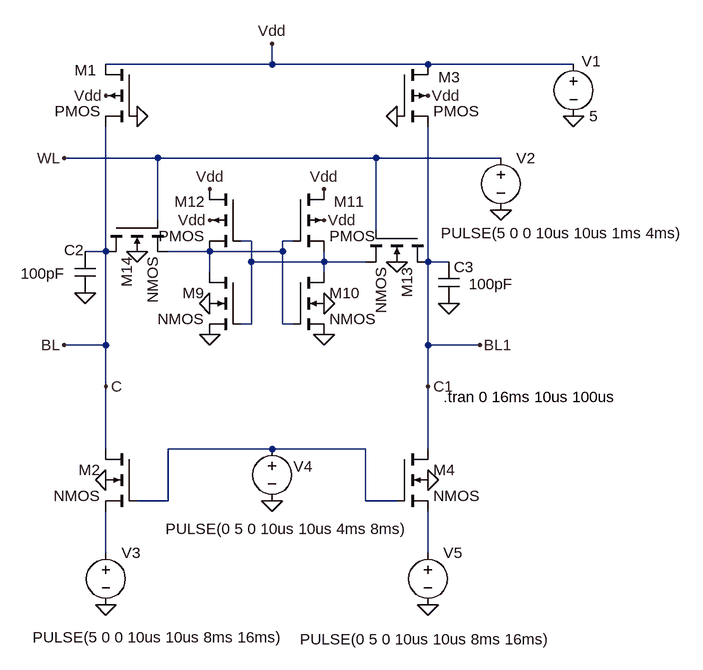
[diagram p0: schematic SRAM.asc]
SRAM.asc, the LTspice schematic file:
Version 4
SHEET 1 1888 884
WIRE 176 -496 176 -528
WIRE 176 -496 -80 -496
WIRE 416 -496 176 -496
WIRE 640 -496 416 -496
WIRE 0 -352 -144 -352
WIRE 336 -352 0 -352
WIRE 528 -352 336 -352
WIRE 0 -256 0 -352
WIRE 336 -240 336 -352
WIRE 144 -224 128 -224
WIRE 208 -224 192 -224
WIRE -80 -208 -80 -400
WIRE -80 -208 -112 -208
WIRE 80 -208 16 -208
WIRE 192 -208 192 -224
WIRE 192 -208 80 -208
WIRE 144 -192 144 -224
WIRE 256 -192 256 -208
WIRE 256 -192 144 -192
WIRE 320 -192 256 -192
WIRE 416 -192 416 -400
WIRE 448 -192 416 -192
WIRE 80 -176 80 -208
WIRE 256 -176 256 -192
WIRE 144 -96 144 -192
WIRE 144 -96 128 -96
WIRE 192 -96 192 -208
WIRE 208 -96 192 -96
WIRE -80 -64 -80 -208
WIRE -80 -64 -144 -64
WIRE 416 -64 416 -192
WIRE 496 -64 416 -64
WIRE -80 0 -80 -64
WIRE 416 0 416 -64
WIRE -80 96 -80 0
WIRE 176 96 16 96
WIRE 320 96 176 96
WIRE 416 96 416 0
WIRE 16 176 16 96
WIRE 16 176 -32 176
WIRE 320 176 320 96
WIRE 368 176 320 176
WIRE -80 256 -80 192
WIRE 416 256 416 192
FLAG -32 -416 0
FLAG 368 -416 0
FLAG -144 -352 WL
FLAG 416 -448 Vdd
FLAG -80 -448 Vdd
FLAG 80 -256 Vdd
FLAG 256 -256 Vdd
FLAG 256 -304 Vdd
FLAG 80 -304 Vdd
FLAG 80 -128 0
FLAG 256 -128 0
FLAG 256 -80 0
FLAG 80 -80 0
FLAG 368 -192 0
FLAG -32 -208 0
FLAG 640 -416 0
FLAG 176 -528 Vdd
FLAG -80 0 C
FLAG 416 0 C1
FLAG 528 -272 0
FLAG -144 -64 BL
FLAG -80 336 0
FLAG -112 -144 0
FLAG 448 -128 0
FLAG -80 144 0
FLAG 416 144 0
FLAG 176 176 0
FLAG 416 336 0
FLAG 496 -64 BL1
SYMBOL pmos4 -32 -496 M0
WINDOW 0 62 9 Left 2
SYMATTR InstName M1
SYMATTR Value2 l=2 w=10
SYMBOL pmos4 368 -496 R0
WINDOW 0 64 20 Left 2
SYMATTR InstName M3
SYMATTR Value2 l=2 w=10
SYMBOL nmos4 128 -176 M0
SYMATTR InstName M9
SYMATTR Value2 l=2 w=10
SYMBOL nmos4 208 -176 R0
SYMATTR InstName M10
SYMATTR Value2 l=2 w=10
SYMBOL pmos4 208 -304 R0
WINDOW 0 63 19 Left 2
SYMATTR InstName M11
SYMATTR Value2 l=2 w=10
SYMBOL pmos4 128 -304 M0
WINDOW 0 55 19 Left 2
SYMATTR InstName M12
SYMATTR Value2 l=2 w=10
SYMBOL nmos4 416 -240 R90
SYMATTR InstName M13
SYMATTR Value2 l=2 w=10
SYMBOL nmos4 -80 -256 M90
SYMATTR InstName M14
SYMATTR Value2 l=2 w=10
SYMBOL voltage 640 -512 R0
WINDOW 123 0 0 Left 2
WINDOW 39 0 0 Left 2
WINDOW 0 13 11 Left 2
SYMATTR InstName V1
SYMATTR Value 5
SYMBOL voltage 528 -368 R0
WINDOW 3 -92 132 Left 2
WINDOW 123 0 0 Left 2
WINDOW 39 0 0 Left 2
SYMATTR Value PULSE(5 0 0 10us 10us 1ms 4ms)
SYMATTR InstName V2
SYMBOL voltage -80 240 R0
WINDOW 3 -113 146 Left 2
WINDOW 123 0 0 Left 2
WINDOW 39 0 0 Left 2
SYMATTR Value PULSE(5 0 0 10us 10us 8ms 16ms)
SYMATTR InstName V3
SYMBOL cap -128 -208 R0
WINDOW 0 -16 -2 Left 2
WINDOW 3 -83 34 Left 2
SYMATTR InstName C2
SYMATTR Value 100pF
SYMBOL cap 432 -192 R0
WINDOW 3 47 34 Left 2
SYMATTR InstName C3
SYMATTR Value 100pF
SYMBOL nmos4 -32 96 M0
SYMATTR InstName M2
SYMATTR Value2 l=2 w=100
SYMBOL nmos4 368 96 R0
SYMATTR InstName M4
SYMATTR Value2 l=2 w=100
SYMBOL voltage 176 80 R0
WINDOW 123 0 0 Left 2
WINDOW 39 0 0 Left 2
WINDOW 0 33 43 Left 2
WINDOW 3 -164 139 Left 2
SYMATTR InstName V4
SYMATTR Value PULSE(0 5 0 10us 10us 4ms 8ms)
SYMBOL voltage 416 240 R0
WINDOW 3 -197 149 Left 2
WINDOW 123 0 0 Left 2
WINDOW 39 0 0 Left 2
SYMATTR InstName V5
SYMATTR Value PULSE(0 5 0 10us 10us 8ms 16ms)
TEXT 440 16 Left 2 !.tran 0 16ms 10us 100us

The netlist it stands for:
* SRAM.asc
M1 Vdd 0 BL Vdd PMOS l=2 w=10
M3 Vdd 0 BL1 Vdd PMOS l=2 w=10
M9 N002 N001 0 0 NMOS l=2 w=10
M10 N001 N002 0 0 NMOS l=2 w=10
M11 Vdd N002 N001 Vdd PMOS l=2 w=10
M12 Vdd N001 N002 Vdd PMOS l=2 w=10
M13 BL1 WL N001 0 NMOS l=2 w=10
M14 BL WL N002 0 NMOS l=2 w=10
V1 Vdd 0 5
V2 WL 0 PULSE(5 0 0 10us 10us 1ms 4ms)
V3 N004 0 PULSE(5 0 0 10us 10us 8ms 16ms)
C2 BL 0 100pF
C3 BL1 0 100pF
M2 BL N003 N004 0 NMOS l=2 w=100
M4 BL1 N003 N005 0 NMOS l=2 w=100
V4 N003 0 PULSE(0 5 0 10us 10us 4ms 8ms)
V5 N005 0 PULSE(0 5 0 10us 10us 8ms 16ms)
.model NMOS NMOS
.model PMOS PMOS
.lib standard.mos
.tran 0 16ms 10us 100us
.backanno
.end